# Altium project Balancing_Robot_1_2.PrjPcb (part 3 of 3)

## Sheet Balancing_Robot_1_2_Main.SchDoc: Hebrides Robot - Main
size A3; DrawnBy: Stuart Taylor; Revision: 1.2; SheetNumber: 1; SheetTotal: 3
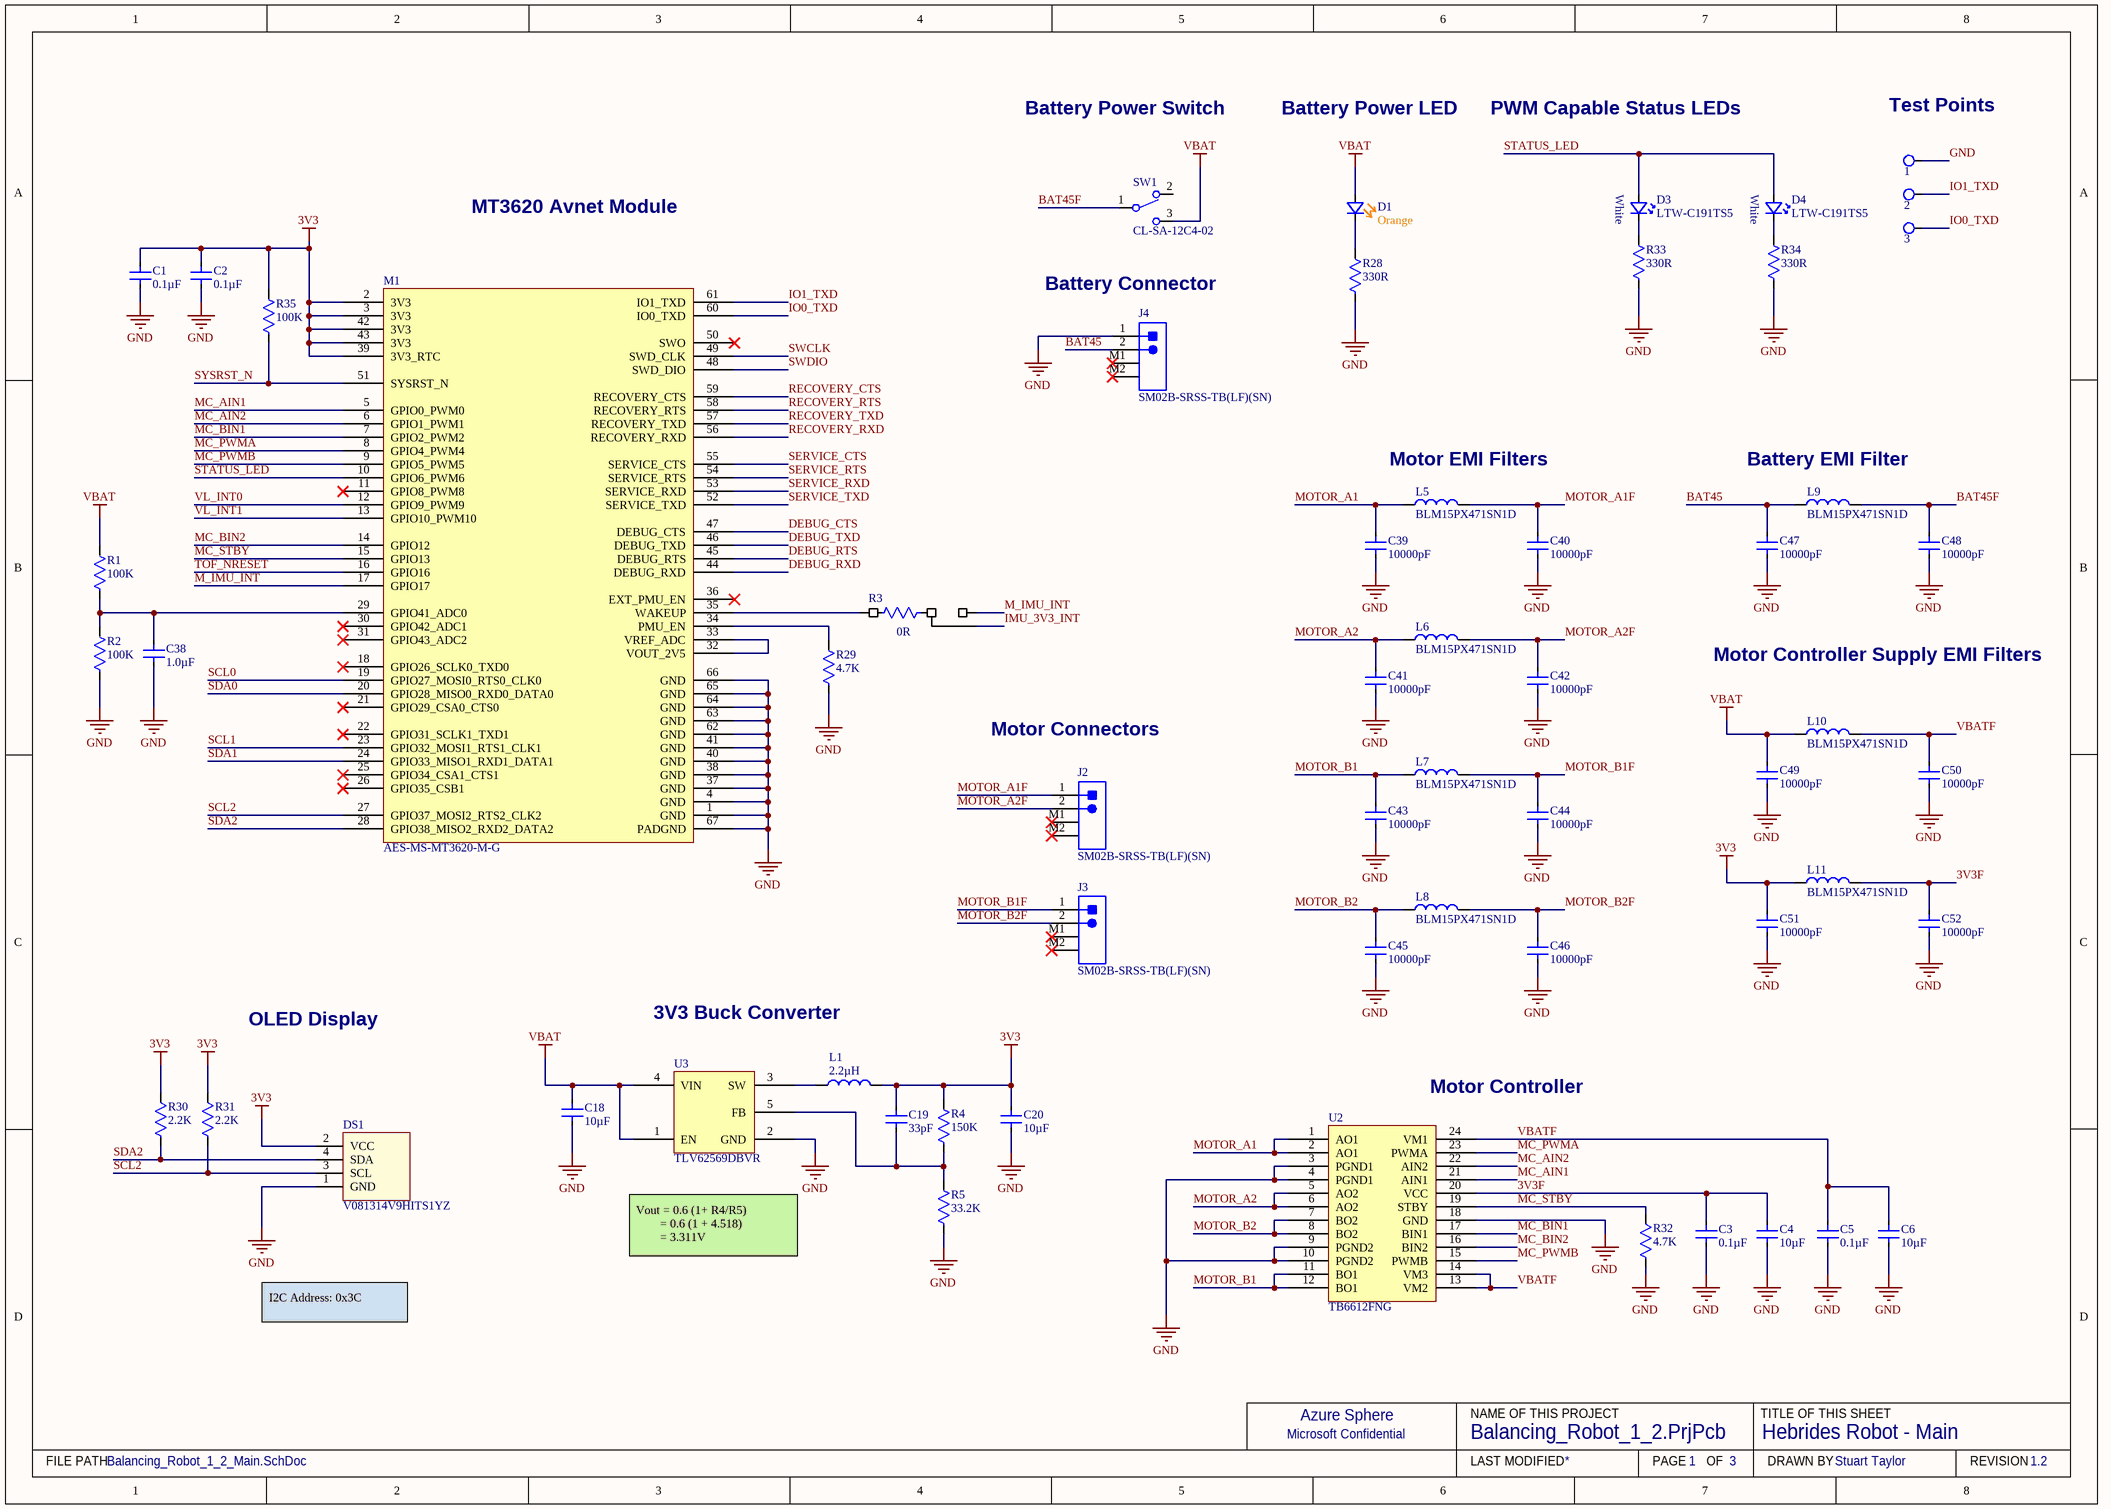
[diagram p2: Balancing_Robot_1_2_Main.SchDoc]

### Parts
1  TestPoint  [Pad1.27mm]  (value not drawn)  (no BOM)
2  TestPoint  [Pad1.27mm]  (value not drawn)  (no BOM)
3  TestPoint  [Pad1.27mm]  (value not drawn)  (no BOM)
C1  0.1µF  [CAPC1005-EIA0402 0.55MM MED]
C2  0.1µF  [CAPC1005-EIA0402 0.55MM MED]
C3  0.1µF  [CAPC1005-EIA0402 0.55MM MED]
C4  10µF  [CAPC1005-EIA0402 0.55MM MED]
C5  0.1µF  [CAPC1005-EIA0402 0.55MM MED]
C6  10µF  [CAPC1005-EIA0402 0.55MM MED]
C18  10µF  [CAPC1608-EIA0603-1MM-MED]
C19  33pF  [CAPC1005-EIA0402 0.55MM MED]
C20  10µF  [CAPC1005-EIA0402 0.55MM MED]
C38  Capacitance: 1.0µF  [CAPC1005-EIA0402 0.55MM MED]  (hidden comment: C1005X5R1V105K050BC)
C39  Capacitance: 10000pF  [CAPC1005-EIA0402 0.55MM MED]  (hidden comment: C1005X7R1H103K050BB)
C40  Capacitance: 10000pF  [CAPC1005-EIA0402 0.55MM MED]  (hidden comment: C1005X7R1H103K050BB)
C41  Capacitance: 10000pF  [CAPC1005-EIA0402 0.55MM MED]  (hidden comment: C1005X7R1H103K050BB)
C42  Capacitance: 10000pF  [CAPC1005-EIA0402 0.55MM MED]  (hidden comment: C1005X7R1H103K050BB)
C43  Capacitance: 10000pF  [CAPC1005-EIA0402 0.55MM MED]  (hidden comment: C1005X7R1H103K050BB)
C44  Capacitance: 10000pF  [CAPC1005-EIA0402 0.55MM MED]  (hidden comment: C1005X7R1H103K050BB)
C45  Capacitance: 10000pF  [CAPC1005-EIA0402 0.55MM MED]  (hidden comment: C1005X7R1H103K050BB)
C46  Capacitance: 10000pF  [CAPC1005-EIA0402 0.55MM MED]  (hidden comment: C1005X7R1H103K050BB)
C47  Capacitance: 10000pF  [CAPC1005-EIA0402 0.55MM MED]  (hidden comment: C1005X7R1H103K050BB)
C48  Capacitance: 10000pF  [CAPC1005-EIA0402 0.55MM MED]  (hidden comment: C1005X7R1H103K050BB)
C49  Capacitance: 10000pF  [CAPC1005-EIA0402 0.55MM MED]  (hidden comment: C1005X7R1H103K050BB)
C50  Capacitance: 10000pF  [CAPC1005-EIA0402 0.55MM MED]  (hidden comment: C1005X7R1H103K050BB)
C51  Capacitance: 10000pF  [CAPC1005-EIA0402 0.55MM MED]  (hidden comment: C1005X7R1H103K050BB)
C52  Capacitance: 10000pF  [CAPC1005-EIA0402 0.55MM MED]  (hidden comment: C1005X7R1H103K050BB)
D1  Colour: Orange  [Rohm SML-D12 Orange]  (hidden comment: SML-D12D)
D3  LTW-C191TS5  [LTW-C191TS5]
D4  LTW-C191TS5  [LTW-C191TS5]
DS1  V081314V9HITS1YZ  [Long_Display]
J2  SM02B-SRSS-TB(LF)(SN)  [SM02B-SRSS-TB]
J3  SM02B-SRSS-TB(LF)(SN)  [SM02B-SRSS-TB]
J4  SM02B-SRSS-TB(LF)(SN)  [SM02B-SRSS-TB]
L1  2.2µH  [NR3015T2R2M]
L5  BLM15PX471SN1D  [Generic Ferrite 0402]
L6  BLM15PX471SN1D  [Generic Ferrite 0402]
L7  BLM15PX471SN1D  [Generic Ferrite 0402]
L8  BLM15PX471SN1D  [Generic Ferrite 0402]
L9  BLM15PX471SN1D  [Generic Ferrite 0402]
L10  BLM15PX471SN1D  [Generic Ferrite 0402]
L11  BLM15PX471SN1D  [Generic Ferrite 0402]
M1  AES-MS-MT3620-M-G  [AES-MS-MT3620-M-G]
R1  100K  [RES 0402 MEDIUM DENSITY]
R2  100K  [RES 0402 MEDIUM DENSITY]
R3  0R  [THREE-WAY-0402-NO-SHORT]
R4  150K  [RES 0402 MEDIUM DENSITY]
R5  33.2K  [RES 0402 MEDIUM DENSITY]
R28  330R  [RES 0402 MEDIUM DENSITY]
R29  4.7K  [RES 0402 MEDIUM DENSITY]
R30  2.2K  [RES 0402 MEDIUM DENSITY]
R31  2.2K  [RES 0402 MEDIUM DENSITY]
R32  4.7K  [RES 0402 MEDIUM DENSITY]
R33  330R  [RES 0402 MEDIUM DENSITY]
R34  330R  [RES 0402 MEDIUM DENSITY]
R35  100K  [RES 0402 MEDIUM DENSITY]
SW1  CL-SA-12C4-02  [CL-SA-12C4-02]
U2  TB6612FNG  [TB6612FNG]
U3  TLV62569DBVR  [TI-SOT23-6]

### Nets
3V3: C1.2 C2.2 C19.2 C20.2 C51.2 DS1.2(VCC) L1.2 L11.1 M1.2(3V3) M1.3(3V3) M1.39(3V3_RTC) M1.42(3V3) M1.43(3V3) R4.1 R30.1 R31.1 R35.1
GND: 1.1 C1.1 C2.1 C3.1 C4.1 C5.1 C6.1 C18.1 C20.1 C38.1 C39.1 C40.1 C41.1 C42.1 C43.1 C44.1 C45.1 C46.1 C47.1 C48.1 C49.1 C50.1 C51.1 C52.1 DS1.1(GND) J4.1 M1.1(GND) M1.4(GND) M1.37(GND) M1.38(GND) M1.40(GND) M1.41(GND) M1.62(GND) M1.63(GND) M1.64(GND) M1.65(GND) M1.66(GND) M1.67(PADGND) R2.2 R5.2 R28.2 R29.2 R32.2 R33.2 R34.2 U2.3(PGND1) U2.4(PGND1) U2.9(PGND2) U2.10(PGND2) U2.18(GND) U3.2(GND)
VBAT: C18.2 C49.2 D1.2(A) L10.1 R1.1 SW1.3 U3.1(EN) U3.4(VIN)
3V3F: C3.2 C4.2 C52.2 L11.2 U2.20(VCC)
BAT45: C47.2 J4.2 L9.1
BAT45F: C48.2 L9.2 SW1.1
DEBUG_CTS: M1.47(DEBUG_CTS)
DEBUG_RTS: M1.45(DEBUG_RTS)
DEBUG_RXD: M1.44(DEBUG_RXD)
DEBUG_TXD: M1.46(DEBUG_TXD)
IMU_3V3_INT: R3.2
IO0_TXD: 3.1 M1.60(IO0_TXD)
IO1_TXD: 2.1 M1.61(IO1_TXD)
M_IMU_INT: M1.17(GPIO17) R3.3
MC_AIN1: M1.5(GPIO0_PWM0) U2.21(AIN1)
MC_AIN2: M1.6(GPIO1_PWM1) U2.22(AIN2)
MC_BIN1: M1.7(GPIO2_PWM2) U2.17(BIN1)
MC_BIN2: M1.14(GPIO12) U2.16(BIN2)
MC_PWMA: M1.8(GPIO4_PWM4) U2.23(PWMA)
MC_PWMB: M1.9(GPIO5_PWM5) U2.15(PWMB)
MC_STBY: M1.15(GPIO13) R32.1 U2.19(STBY)
MOTOR_A1: C39.2 L5.1 U2.1(AO1) U2.2(AO1)
MOTOR_A1F: C40.2 J2.1 L5.2
MOTOR_A2: C41.2 L6.1 U2.5(AO2) U2.6(AO2)
MOTOR_A2F: C42.2 J2.2 L6.2
MOTOR_B1: C43.2 L7.1 U2.11(BO1) U2.12(BO1)
MOTOR_B1F: C44.2 J3.1 L7.2
MOTOR_B2: C45.2 L8.1 U2.7(BO2) U2.8(BO2)
MOTOR_B2F: C46.2 J3.2 L8.2
RECOVERY_CTS: M1.59(RECOVERY_CTS)
RECOVERY_RTS: M1.58(RECOVERY_RTS)
RECOVERY_RXD: M1.56(RECOVERY_RXD)
RECOVERY_TXD: M1.57(RECOVERY_TXD)
SCL0: M1.19(GPIO27_MOSI0_RTS0_CLK0)
SCL1: M1.23(GPIO32_MOSI1_RTS1_CLK1)
SCL2: DS1.3(SCL) M1.27(GPIO37_MOSI2_RTS2_CLK2) R31.2
SDA0: M1.20(GPIO28_MISO0_RXD0_DATA0)
SDA1: M1.24(GPIO33_MISO1_RXD1_DATA1)
SDA2: DS1.4(SDA) M1.28(GPIO38_MISO2_RXD2_DATA2) R30.2
SERVICE_CTS: M1.55(SERVICE_CTS)
SERVICE_RTS: M1.54(SERVICE_RTS)
SERVICE_RXD: M1.53(SERVICE_RXD)
SERVICE_TXD: M1.52(SERVICE_TXD)
STATUS_LED: D3.2(A) D4.2(A) M1.10(GPIO6_PWM6)
SWCLK: M1.49(SWD_CLK)
SWDIO: M1.48(SWD_DIO)
SYSRST_N: M1.51(SYSRST_N) R35.2
TOF_NRESET: M1.16(GPIO16)
VBATF: C5.2 C6.2 C50.2 L10.2 U2.13(VM2) U2.14(VM3) U2.24(VM1)
VL_INT0: M1.12(GPIO9_PWM9)
VL_INT1: M1.13(GPIO10_PWM10)
NetC19_1: C19.1 R4.2 R5.1 U3.5(FB)
NetC38_2: C38.2 M1.29(GPIO41_ADC0) R1.2 R2.1
NetD1_1: D1.1(K) R28.1
NetD3_1: D3.1(K) R33.1
NetD4_1: D4.1(K) R34.1
NetL1_1: L1.1 U3.3(SW)
NetM1_32: M1.32(VOUT_2V5) M1.33(VREF_ADC)
NetM1_34: M1.34(PMU_EN) R29.1
NetM1_35: M1.35(WAKEUP) R3.1

Not connected (* = marked no-connect by the designer): J2 M1* M2*; J3 M1* M2*; J4 M1* M2*; M1 11(GPIO8_PWM8)* 18(GPIO26_SCLK0_TXD0)* 21(GPIO29_CSA0_CTS0)* 22(GPIO31_SCLK1_TXD1)* 25(GPIO34_CSA1_CTS1)* 26(GPIO35_CSB1)* 30(GPIO42_ADC1)* 31(GPIO43_ADC2)* 36(EXT_PMU_EN)* 50(SWO)*; SW1 2

### Notes on the sheet
- (near 1) Test Points
- Battery Power Switch
- Battery Power LED
- PWM Capable Status LEDs
- MT3620 Avnet Module
- Battery Connector
- (near L5) Motor EMI Filters
- (near L9) Battery EMI Filter
- Motor Controller Supply EMI Filters
- Motor Connectors
- OLED Display
- 3V3 Buck Converter
- (near U2) Motor Controller
- Vout = 0.6 (1+ R4/R5)
  = 0.6 (1 + 4.518)
  = 3.311V
- I2C Address: 0x3C
- Microsoft Confidential
- Azure Sphere
- NAME OF THIS PROJECT
- TITLE OF THIS SHEET
- FILE PATH
- LAST MODIFIED
- PAGE
- OF
- DRAWN BY
- REVISION

### Library data of the parts
1-3 = TestPoint: Test Point
C1-C3 C5 = 0.1µF 0402 X7R 50V: CAP CER 0.1UF 50V 10% X7R 0402; Manufacturer: TDK Corporation; Manufacturer Part Number: C1005X7R1H104K050BB; Supplier 1: Digi-Key; RoHS: RoHS Compliant; Category: Capacitors; Stock 1: 47833; Pricing 1: 0.01305; Packaging: Tape & Reel (TR); Tolerance: ±10%; Voltage - Rated: 50V; Temperature Coefficient: X7R; Mounting Type: Surface Mount, MLCC; Operating Temperature: -55°C ~ 125°C; Applications: General Purpose; Package / Case: 0402 (1005 Metric); Size / Dimension: 0.039" L x 0.020" W (1.00mm x 0.50mm); Height - Seated (Max): -; Thickness (Max): 0.022" (0.55mm); Lead Spacing: -; Features: -; Lead Style: -; ComponentLink1URL: http://product.tdk.com/en/catalog/datasheets/mlcc_commercial_general_en.pdf; ComponentLink1Description: http://product.tdk.com/en/catalog/datasheets/mlcc_commercial_general_en.pdf; Supplier Part Number 1: 445-5932-2-ND; Ratings: -; Capacitance: 0.1µF
C4 C6 C20 = 10µF 0402 X5R 6.3V: CAP CER 10UF 6.3V 20% X5R 0402; Manufacturer: TDK Corporation; Manufacturer Part Number: C1005X5R0J106M050BC; Supplier 1: Digi-Key; RoHS: RoHS Compliant; Category: Capacitors; Stock 1: 47833; Pricing 1: 0.07766; Packaging: Tape & Reel (TR); Tolerance: ±20%; Voltage - Rated: 6.3V; Temperature Coefficient: X5R; Mounting Type: Surface Mount, MLCC; Operating Temperature: -55°C ~ 125°C; Applications: General Purpose; Package / Case: 0402 (1005 Metric); Size / Dimension: 0.039" L x 0.020" W (1.00mm x 0.50mm); Height - Seated (Max): -; Thickness (Max): 0.020" (0.50mm); Lead Spacing: -; Features: -; Lead Style: -; ComponentLink1URL: http://product.tdk.com/en/catalog/datasheets/mlcc_commercial_general_en.pdf; ComponentLink1Description: http://product.tdk.com/en/catalog/datasheets/mlcc_commercial_general_en.pdf; Supplier Part Number 1: 445-8920-2-ND; Ratings: -; Capacitance: 10µF
C18 = 10µF 0603 X5R 25V: CAP CER 10UF 25V 20% X5R 0603; Manufacturer: TDK Corporation; Manufacturer Part Number: C1608X5R1E106M080AC; Supplier 1: Digi-Key; RoHS: RoHS Compliant; Category: Capacitors; Stock 1: 47833; Pricing 1: 0.00754; Packaging: Tape & Reel (TR); Tolerance: ±20%; Voltage - Rated: 25V; Temperature Coefficient: X5R; Mounting Type: Surface Mount, MLCC; Operating Temperature: -55°C ~ 125°C; Applications: General Purpose; Package / Case: 0603 (1608 Metric); Size / Dimension: 0.063" L x 0.031" W (1.60mm x 0.80mm); Height - Seated (Max): -; Thickness (Max): 0.039" (1.00mm); Lead Spacing: -; Features: -; Lead Style: -; ComponentLink1URL: http://product.tdk.com/en/catalog/datasheets/mlcc_commercial_general_en.pdf; ComponentLink1Description: http://product.tdk.com/en/catalog/datasheets/mlcc_commercial_general_en.pdf; Supplier Part Number 1: 445-9015-2-ND; Ratings: -; Capacitance: 10µF
C19 = 33pF 0402 C0G, NP0 50V: CAP CER 33PF 50V 5% NP0 0402; Manufacturer: TDK Corporation; Manufacturer Part Number: C1005C0G1H330J050BA; Supplier 1: Digi-Key; RoHS: RoHS Compliant; Category: Capacitors; Stock 1: 47833; Pricing 1: 0.00274; Packaging: Tape & Reel (TR); Tolerance: ±5%; Voltage - Rated: 50V; Temperature Coefficient: C0G, NP0; Mounting Type: Surface Mount, MLCC; Operating Temperature: -55°C ~ 125°C; Applications: General Purpose; Package / Case: 0402 (1005 Metric); Size / Dimension: 0.039" L x 0.020" W (1.00mm x 0.50mm); Height - Seated (Max): -; Thickness (Max): 0.022" (0.55mm); Lead Spacing: -; Features: -; Lead Style: -; ComponentLink1URL: http://product.tdk.com/en/catalog/datasheets/mlcc_commercial_general_en.pdf; ComponentLink1Description: http://product.tdk.com/en/catalog/datasheets/mlcc_commercial_general_en.pdf; Supplier Part Number 1: 445-1241-2-ND; Ratings: -; Capacitance: 33pF
C38 = 1.0µF 0402 X5R 35V: CAP CER 1UF 35V 10% X5R 0402; Manufacturer: TDK Corporation; Supplier 1: Digi-Key; Manufacturer Part Number: C1005X5R1V105K050BC; RoHS: RoHS Compliant; Category: Capacitors; Stock 1: 47833; Pricing 1: 0.0186; Packaging: Tape & Reel (TR); Tolerance: ±10%; Voltage - Rated: 35V; Temperature Coefficient: X5R; Mounting Type: Surface Mount, MLCC; Operating Temperature: -55°C ~ 125°C; Applications: General Purpose; Package / Case: 0402 (1005 Metric); Size / Dimension: 0.039" L x 0.020" W (1.00mm x 0.50mm); Height - Seated (Max): -; Thickness (Max): 0.022" (0.55mm); Lead Spacing: -; Features: -; Lead Style: -; ComponentLink1URL: http://product.tdk.com/en/catalog/datasheets/mlcc_commercial_general_en.pdf; ComponentLink1Description: http://product.tdk.com/en/catalog/datasheets/mlcc_commercial_general_en.pdf; Supplier Part Number 1: 445-9073-2-ND; Ratings: -
C39-C52 = 10000pF 0402 X7R 50V: CAP CER 10000PF 50V 10% X7R 0402; Manufacturer: TDK Corporation; Supplier 1: Digi-Key; Manufacturer Part Number: C1005X7R1H103K050BB; RoHS: RoHS Compliant; Category: Capacitors; Stock 1: 47833; Pricing 1: 0.00685; Packaging: Tape & Reel (TR); Tolerance: ±10%; Voltage - Rated: 50V; Temperature Coefficient: X7R; Mounting Type: Surface Mount, MLCC; Operating Temperature: -55°C ~ 125°C; Applications: General Purpose; Package / Case: 0402 (1005 Metric); Size / Dimension: 0.039" L x 0.020" W (1.00mm x 0.50mm); Height - Seated (Max): -; Thickness (Max): 0.022" (0.55mm); Lead Spacing: -; Features: -; Lead Style: -; ComponentLink1URL: http://product.tdk.com/en/catalog/datasheets/mlcc_commercial_general_en.pdf; ComponentLink1Description: http://product.tdk.com/en/catalog/datasheets/mlcc_commercial_general_en.pdf; Supplier Part Number 1: 445-6850-2-ND; Ratings: -
D1 = SML-D12D: 1.6 x 0.8 x 0.55mm (0603) LED 605nm Orange; Manufacturer: Rohm Semiconductor; Manufacturer Part Number: SML-D12D8WT86; Millicandela Rating: 100mcd; Voltage - Forward (Vf) (Typ): 2.2V; Current - Test: 20mA; Lens Type: Diffused, White; Lens Style/Size: Rectangle with Flat Top, 1.2mm x 0.8mm; Supplier 1: Digi-Key; RoHS: RoHS Compliant; Category: Optoelectronics; Stock 1: 1719; Pricing 1: 1=0.38, 10=0.279, 25=0.2232, 100=0.1478, 250=0.1046, 500=0.08926, 1000=0.06974 (GBP); Packaging: Cut Tape (CT); Wavelength - Dominant: 605nm; Wavelength - Peak: -; Viewing Angle: -; Package / Case: 0603 (1608 Metric); Size / Dimension: 1.60mm L x 0.80mm W; Height: 0.55mm; Mounting Type: Surface Mount; Luminous Flux @ Current - Test: -; ComponentLink1URL: http://rohmfs.rohm.com/en/products/databook/datasheet/opto/led/chip_mono/sml-d1.pdf; ComponentLink1Description: http://rohmfs.rohm.com/en/products/databook/datasheet/opto/led/chip_mono/sml-d1.pdf; Supplier Part Number 1: 511-1577-1-ND
D3 D4 = LTW-C191TS5: LED Uni-Color White 2-Pin Chip LED T/R; Manufacturer: Vishay Lite-On; Colour: White,Yellow; Lens Colour: Clear; Viewing Angle: 130°; Lens Style: Diffused,Colored,Rectangular,Tinted; Forward Current: 20mA; Forward Voltage: 3.15V; Power Rating: 70mW; Luminous Intensity: 112mcd; Test Current: 5mA; Correlated Colour Temperature (CCT): x=0.294/y=0.286; Number of Elements: 1; Reverse Voltage: 5V; Supplier 1: Digi-Key; Manufacturer Part Number: LTW-C191TS5; Stock 1: 149804; Pricing 1: 1=0.51, 10=0.396, 25=0.33, 100=0.2843, 250=0.2538, 500=0.2183, 1000=0.1685, 2500=0.1523 (USD); Mount: Surface Mount; Case/Package: 0603; Number of Pins: 2; Case Code (Metric): 1608; Case Code (Imperial): 0603; Min Operating Temperature: -20°C; Max Operating Temperature: 80°C; Package Quantity: 1; Packaging: Tape and Reel; Illumination Colour: White; Power Dissipation: 70mW; Number of LEDs: 1; Length: 1.6mm; Height: 0.55mm; Width: 0.8mm; Depth: 0.8mm; Radiation Hardening: No; Lead Free: Lead Free; ComponentLink1URL: https://datasheet.ciiva.com/11774/0900766b80e28fab-11774237.pdf; ComponentLink1Description: https://datasheet.ciiva.com/11774/0900766b80e28fab-11774237.pdf; ComponentLink2URL: https://datasheet.ciiva.com/25775/ltw-c191ts5-25775221.pdf; ComponentLink2Description: https://datasheet.ciiva.com/25775/ltw-c191ts5-25775221.pdf; ComponentLink3URL: https://datasheet.ciiva.com/15117/getdatasheetpartid-145287-15117825.pdf; ComponentLink3Description: https://datasheet.ciiva.com/15117/getdatasheetpartid-145287-15117825.pdf; ComponentLink4URL: https://datasheet.ciiva.com/12403/lite-on-ltw-c191ts5-190110-12403904.pdf; ComponentLink4Description: https://datasheet.ciiva.com/12403/lite-on-ltw-c191ts5-190110-12403904.pdf; ComponentLink5URL: https://datasheet.ciiva.com/26913/ltw-c191ts5-26913715.pdf; ComponentLink5Description: https://datasheet.ciiva.com/26913/ltw-c191ts5-26913715.pdf; ComponentLink6URL: https://datasheet.ciiva.com/16388/ltw-c191ts5-16388573.pdf; ComponentLink6Description: https://datasheet.ciiva.com/16388/ltw-c191ts5-16388573.pdf; ComponentLink7URL: https://datasheet.ciiva.com/2111/s-110-ltw-c191ts5-2111264.pdf; ComponentLink7Description: https://datasheet.ciiva.com/2111/s-110-ltw-c191ts5-2111264.pdf; Supplier Part Number 1: 160-1724-1-ND
J2-J4 = SM02B-SRSS-TB(LF)(SN): Conn Shrouded Header HDR 2 POS 1mm Solder RA SMD T/R; Manufacturer: JST; Number of Contacts: 2; Voltage Rating: 50V; Current Rating: 700mA; Insulation Resistance: 100MR; Connector Type: Header,Male Pin; Contact Resistance: 40mR; Max Current Rating: 1A; Supplier 1: Farnell; Manufacturer Part Number: SM02B-SRSS-TB(LF)(SN); Stock 1: 47603; Pricing 1: 100=0.24600, 500=0.21400, 1000=0.17700, 2500=0.15600, 5000=0.13600, 10000=0.13000 (GBP); RoHS: Yes; Mount: Surface Mount; Contact Material: Copper Alloy,Copper; Housing Color: Beige; Material: Polyamide; Housing Material: Polyamide; Contact Shape: Square; Insulation Material: Nylon; Insulation Color: Natural; Color: Natural; Contact Plating: Tin,Copper,Lead; Min Operating Temperature: -25°C; Max Operating Temperature: 85°C; Orientation: Right Angle; Termination: Solder; Number of Rows: 1; Number of Positions: 2; Max Voltage Rating (AC): 50V; Fastening Type: Push,Pull; Packaging: Tape and Reel; Voltage Rating (AC): 50V; Length: 4mm; Pitch: 1mm; Depth: 4.95mm; Lead Pitch: 1mm; Flammability Rating: UL94 V-0; Lead Free: Lead Free; REACH SVHC: No SVHC; ComponentLink1URL: https://datasheet.ciiva.com/26924/getdatasheetpartid-640850-26924055.pdf?src-supplier=Verical; ComponentLink1Description: https://datasheet.ciiva.com/26924/getdatasheetpartid-640850-26924055.pdf?src-supplier=Verical; ComponentLink2URL: https://datasheet.ciiva.com/712/esr-712467.pdf?src-supplier=Digi-Key; ComponentLink2Description: https://datasheet.ciiva.com/712/esr-712467.pdf?src-supplier=Digi-Key; ComponentLink3URL: https://datasheet.ciiva.com/712/esr-712468.pdf?src-supplier=Digi-Key; ComponentLink3Description: https://datasheet.ciiva.com/712/esr-712468.pdf?src-supplier=Digi-Key; ComponentLink4URL: https://datasheet.ciiva.com/730/esr-730600.pdf?src-supplier=Digi-Key; ComponentLink4Description: https://datasheet.ciiva.com/730/esr-730600.pdf?src-supplier=Digi-Key; ComponentLink5URL: https://datasheet.ciiva.com/8052/91630-8052284.pdf?src-supplier=Element14; ComponentLink5Description: https://datasheet.ciiva.com/8052/91630-8052284.pdf?src-supplier=Element14; ComponentLink6URL: https://datasheet.ciiva.com/16391/sm02b-srss-tblfsn-16391308.pdf?src-supplier=Future+Electronics; ComponentLink6Description: https://datasheet.ciiva.com/16391/sm02b-srss-tblfsn-16391308.pdf?src-supplier=Future+Electronics; Supplier Part Number 1: 1679117
L1 = NR3015T2R2M: FIXED IND 2.2UH 1.5A 72 MOHM SMD; Manufacturer: Taiyo Yuden; Type: Wirewound; Material - Core: Ferrite; Tolerance: ±20%; Current - Saturation: 1.48A; Shielding: Shielded; DC Resistance (DCR): 72 mOhm Max; Frequency - Self Resonant: 64MHz; Frequency - Test: 100kHz; Supplier 1: Digi-Key; Manufacturer Part Number: NR3015T2R2M; RoHS: RoHS Compliant; Category: Inductors, Coils, Chokes; Stock 1: 150589; Pricing 1: 1=0.23, 10=0.209, 25=0.1864, 50=0.163, 100=0.1513, 250=0.13964, 500=0.13268, 1000=0.10707 (GBP); Packaging: Cut Tape (CT); Inductance: 2.2µH; Current Rating: 1.5A; Q @ Freq: -; Ratings: -; Operating Temperature: -25°C ~ 120°C; Mounting Type: Surface Mount; Package / Case: Nonstandard; Size / Dimension: 0.118" L x 0.118" W (3.00mm x 3.00mm); Height - Seated (Max): 0.059" (1.50mm); ComponentLink1URL: http://ds.yuden.co.jp/TYCOMPAS/ut/detail.do?productNo=NR3015T2R2M&fileName=NR3015T2R2M_SS&mode=specSheetDownload; ComponentLink1Description: http://ds.yuden.co.jp/TYCOMPAS/ut/detail.do?productNo=NR3015T2R2M&fileName=NR3015T2R2M_SS&mode=specSheetDownload; Supplier Part Number 1: 587-1648-1-ND
L5-L11 = BLM15PX471SN1D: Murata; Material: Steel; Max DC Current: 1A; DC Resistance (DCR): 200mR; Test Frequency: 100MHz; Tolerance: 25%; Impedance: 470R; Number of Circuits: 1; Supplier 1: Digi-Key; Manufacturer: Murata; Manufacturer Part Number: BLM15PX471SN1D; Stock 1: 97005; Pricing 1: 1=0.15000, 10=0.12300, 25=0.09560, 50=0.07920, 100=0.06820, 250=0.05456, 500=0.04910, 1000=0.04092, 5000=0.03819 (USD); RoHS: Yes; Case/Package: 0402; Number of Pins: 2; Case Code (Imperial): 0402; Case Code (Metric): 1005; Min Operating Temperature: -55°C; Max Operating Temperature: 125°C; Termination: SMD/SMT; Packaging: Tape and Reel; Current Rating: 1A; Package Quantity: 1; Number of Lines: 1; Max Current Rating: 1A; Length: 1mm; Height: 0.5mm; Width: 0.5mm; Lead Free: Lead Free; ComponentLink1URL: https://datasheet.ciiva.com/41449/001172215-da-01-en-drossel-0402-470r-1-0x0-5mm-10000st-41449502.pdf?src-supplier=Conrad; ComponentLink1Description: https://datasheet.ciiva.com/41449/001172215-da-01-en-drossel-0402-470r-1-0x0-5mm-10000st-41449502.pdf?src-supplier=Conrad; ComponentLink2URL: https://datasheet.ciiva.com/29364/l0110e-29364075.pdf?src-supplier=Digi-Key; ComponentLink2Description: https://datasheet.ciiva.com/29364/l0110e-29364075.pdf?src-supplier=Digi-Key; Supplier Part Number 1: 490-10662-1-ND
M1 = AES-MS-MT3620-M-G (SAT)
R1 R2 R35 = 100K: RES 100K OHM 1/10W 1% 0402 SMD; Manufacturer: Panasonic Electronic Components; Manufacturer Part Number: ERJ-2RKF1003X; Power (Watts): 0.1W, 1/10W; Temperature Coefficient: ±100ppm/°C; Supplier 1: Digi-Key; Supplier Part Number 1: P100KLCT-ND; RoHS: RoHS Compliant; Category: Resistors; Stock 1: 2310913; Pricing 1: 1=0.07, 50=0.0128, 100=0.0097, 250=0.0072, 500=0.00532, 1000=0.00355, 5000=0.0025 (GBP); Packaging: Cut Tape (CT); Tolerance: ±1%; Composition: Thick Film; Features: -; Package / Case: 0402 (1005 Metric); Supplier Device Package: 0402; Size / Dimension: 0.039" L x 0.020" W (1.00mm x 0.50mm); Height: 0.016" (0.40mm); Number of Terminations: 2; ComponentLink1URL: http://industrial.panasonic.com/www-cgi/jvcr13pz.cgi?E+PZ+3+AOA0002+ERJ2RKF1003X+7+WW; ComponentLink1Description: http://industrial.panasonic.com/www-cgi/jvcr13pz.cgi?E+PZ+3+AOA0002+ERJ2RKF1003X+7+WW; Resistance (Ohms): 100K
R3 = THREE-WAY-0R-0402-NO-SHORT: RES SMD 0.0OHM JUMPER 1/10W 0402; Manufacturer: Panasonic Electronic Components; Manufacturer Part Number: ERJ-2GE0R00X; Resistance (Ohms): 0.0; Power (Watts): 0.1W, 1/10W; Supplier 1: Digi-Key; RoHS: RoHS Compliant; Category: Resistors; Stock 1: 3259868; Pricing 1: 1=0.08, 50=0.0104, 100=0.0079, 250=0.00588, 500=0.00436, 1000=0.0029, 5000=0.00204 (GBP); Packaging: Cut Tape (CT); Part Status: Active; Tolerance: Jumper; Composition: Thick Film; Features: Automotive AEC-Q200; Temperature Coefficient: -; Operating Temperature: -55°C ~ 155°C; Package / Case: 0402 (1005 Metric); Supplier Device Package: 0402; Size / Dimension: 0.039" L x 0.020" W (1.00mm x 0.50mm); Height: 0.016" (0.40mm); Number of Terminations: 2; Failure Rate: -; ComponentLink1URL: http://industrial.panasonic.com/www-cgi/jvcr13pz.cgi?E+PZ+3+AOA0001+ERJ2GE0R00X+7+WW; ComponentLink1Description: http://industrial.panasonic.com/www-cgi/jvcr13pz.cgi?E+PZ+3+AOA0001+ERJ2GE0R00X+7+WW; Supplier Part Number 1: P0.0JCT-ND
R4 = 150K: RES 150K OHM 1/10W 1% 0402 SMD; Manufacturer: Panasonic Electronic Components; Manufacturer Part Number: ERJ-2RKF1503X; Power (Watts): 0.1W, 1/10W; Temperature Coefficient: ±100ppm/°C; Supplier 1: Digi-Key; Supplier Part Number 1: P150KLCT-ND; RoHS: RoHS Compliant; Category: Resistors; Stock 1: 330002; Pricing 1: 1=0.07, 50=0.0128, 100=0.0097, 250=0.0072, 500=0.00532, 1000=0.00355, 5000=0.0025 (GBP); Packaging: Cut Tape (CT); Tolerance: ±1%; Composition: Thick Film; Features: -; Package / Case: 0402 (1005 Metric); Supplier Device Package: 0402; Size / Dimension: 0.039" L x 0.020" W (1.00mm x 0.50mm); Height: 0.016" (0.40mm); Number of Terminations: 2; ComponentLink1URL: http://industrial.panasonic.com/www-cgi/jvcr13pz.cgi?E+PZ+3+AOA0002+ERJ2RKF1503X+7+WW; ComponentLink1Description: http://industrial.panasonic.com/www-cgi/jvcr13pz.cgi?E+PZ+3+AOA0002+ERJ2RKF1503X+7+WW; Resistance (Ohms): 150K
R5 = 33.2K: RES 33.2K OHM 1/10W 1% 0402 SMD; Manufacturer: Panasonic Electronic Components; Manufacturer Part Number: ERJ-2RKF3322X; Power (Watts): 0.1W, 1/10W; Temperature Coefficient: ±100ppm/°C; Supplier 1: Digi-Key; Supplier Part Number 1: P33.2KLCT-ND; RoHS: RoHS Compliant; Category: Resistors; Stock 1: 313628; Pricing 1: 1=0.07, 50=0.0128, 100=0.0097, 250=0.0072, 500=0.00532, 1000=0.00355, 5000=0.0025 (GBP); Packaging: Cut Tape (CT); Tolerance: ±1%; Composition: Thick Film; Features: -; Package / Case: 0402 (1005 Metric); Supplier Device Package: 0402; Size / Dimension: 0.039" L x 0.020" W (1.00mm x 0.50mm); Height: 0.016" (0.40mm); Number of Terminations: 2; ComponentLink1URL: http://industrial.panasonic.com/www-cgi/jvcr13pz.cgi?E+PZ+3+AOA0002+ERJ2RKF3322X+7+WW; ComponentLink1Description: http://industrial.panasonic.com/www-cgi/jvcr13pz.cgi?E+PZ+3+AOA0002+ERJ2RKF3322X+7+WW; Resistance (Ohms): 33.2K
R28 R33 R34 = 330R: RES 330 OHM 1/10W 1% 0402 SMD; Manufacturer: Panasonic Electronic Components; Manufacturer Part Number: ERJ-2RKF3300X; Power (Watts): 0.1W, 1/10W; Temperature Coefficient: ±100ppm/°C; Supplier 1: Digi-Key; Supplier Part Number 1: P330LCT-ND; RoHS: RoHS Compliant; Category: Resistors; Stock 1: 586957; Pricing 1: 1=0.07, 50=0.0128, 100=0.0097, 250=0.0072, 500=0.00532, 1000=0.00355, 5000=0.0025 (GBP); Packaging: Cut Tape (CT); Tolerance: ±1%; Composition: Thick Film; Features: -; Package / Case: 0402 (1005 Metric); Supplier Device Package: 0402; Size / Dimension: 0.039" L x 0.020" W (1.00mm x 0.50mm); Height: 0.016" (0.40mm); Number of Terminations: 2; ComponentLink1URL: http://industrial.panasonic.com/www-cgi/jvcr13pz.cgi?E+PZ+3+AOA0002+ERJ2RKF3300X+7+WW; ComponentLink1Description: http://industrial.panasonic.com/www-cgi/jvcr13pz.cgi?E+PZ+3+AOA0002+ERJ2RKF3300X+7+WW; Resistance (Ohms): 330R
R29 R32 = 4.7K: RES 4.7K OHM 1/10W 1% 0402 SMD; Manufacturer: Panasonic Electronic Components; Manufacturer Part Number: ERJ-2RKF4701X; Power (Watts): 0.1W, 1/10W; Temperature Coefficient: ±100ppm/°C; Supplier 1: Digi-Key; Supplier Part Number 1: P4.70KLCT-ND; RoHS: RoHS Compliant; Category: Resistors; Stock 1: 1251398; Pricing 1: 1=0.07, 50=0.0128, 100=0.0097, 250=0.0072, 500=0.00532, 1000=0.00355, 5000=0.0025 (GBP); Packaging: Cut Tape (CT); Tolerance: ±1%; Composition: Thick Film; Features: -; Package / Case: 0402 (1005 Metric); Supplier Device Package: 0402; Size / Dimension: 0.039" L x 0.020" W (1.00mm x 0.50mm); Height: 0.016" (0.40mm); Number of Terminations: 2; ComponentLink1URL: http://industrial.panasonic.com/www-cgi/jvcr13pz.cgi?E+PZ+3+AOA0002+ERJ2RKF4701X+7+WW; ComponentLink1Description: http://industrial.panasonic.com/www-cgi/jvcr13pz.cgi?E+PZ+3+AOA0002+ERJ2RKF4701X+7+WW; Resistance (Ohms): 4.7K
R30 R31 = 2.2K: RES 2.2K OHM 1/10W 1% 0402 SMD; Manufacturer: Panasonic Electronic Components; Manufacturer Part Number: ERJ-2RKF2201X; Power (Watts): 0.1W, 1/10W; Temperature Coefficient: ±100ppm/°C; Supplier 1: Digi-Key; Supplier Part Number 1: P2.20KLCT-ND; RoHS: RoHS Compliant; Category: Resistors; Stock 1: 529147; Pricing 1: 1=0.07, 50=0.0128, 100=0.0097, 250=0.0072, 500=0.00532, 1000=0.00355, 5000=0.0025 (GBP); Packaging: Cut Tape (CT); Tolerance: ±1%; Composition: Thick Film; Features: -; Package / Case: 0402 (1005 Metric); Supplier Device Package: 0402; Size / Dimension: 0.039" L x 0.020" W (1.00mm x 0.50mm); Height: 0.016" (0.40mm); Number of Terminations: 2; ComponentLink1URL: http://industrial.panasonic.com/www-cgi/jvcr13pz.cgi?E+PZ+3+AOA0002+ERJ2RKF2201X+7+WW; ComponentLink1Description: http://industrial.panasonic.com/www-cgi/jvcr13pz.cgi?E+PZ+3+AOA0002+ERJ2RKF2201X+7+WW; Resistance (Ohms): 2.2K
SW1 = CL-SA-12C4-02: SWITCH SLIDE SPDT 500MA 12V; Manufacturer: Nidec Copal; Mechanical Life: 10000Cycles; Switch Travel: 1.6mm; Actuator Type: Standard; Switch Function: On-On; Contact Style: Non-Shorting; Electrical Life: 2000Cycles; Operating Force: 255gf; Actuator Length: 1.4mm; Supplier 1: Digi-Key; Manufacturer Part Number: CL-SA-12C4-02; Stock 1: 458; Pricing 1: 1=2.65000, 10=2.54200, 25=2.48760, 50=2.16320, 100=2.10910, 250=2.05504, 500=1.73056, 1000=1.62240, 5000=1.48720 (USD); RoHS: Yes; Mount: Through Hole; Contact Material: Gold; Min Operating Temperature: -40°C; Max Operating Temperature: 85°C; Termination: PC Pin; Packaging: Bulk; Current Rating: 500mA; Voltage Rating (DC): 12V; Throw Configuration: SPDT; Lead Free: Lead Free; ComponentLink1URL: https://datasheet.ciiva.com/18516/02682-18516832.pdf?src-supplier=Digi-Key; ComponentLink1Description: https://datasheet.ciiva.com/18516/02682-18516832.pdf?src-supplier=Digi-Key; Supplier Part Number 1: 563-1386-ND
U2 = TB6612FNG: DC Motor Driver 3V 24-Pin SSOP T/R; Manufacturer: Toshiba; Manufacturer Part Number: TB6612FNG,C,8,EL; Output Current: 1A; Number of Outputs: 2; Logic Function: AND; Interface: Parallel; Min Supply Voltage: 2.7V; Max Supply Voltage: 5.5V; Supplier 1: Digi-Key; Stock 1: 11070; Pricing 1: 1=1.95000, 10=1.74900, 25=1.65000, 100=1.32000, 250=1.15500, 500=1.12200, 1000=0.89100 (USD); RoHS: Yes; Mount: Surface Mount; Case/Package: SSOP; Number of Pins: 24; Min Operating Temperature: -20°C; Max Operating Temperature: 85°C; Package Quantity: 1; Packaging: Tape and Reel; Operating Supply Voltage: 3V; ComponentLink1URL: https://datasheet.ciiva.com/12216/tb6612fng-datasheet-en-20141001-12216529.pdf?src-supplier=Mouser; ComponentLink1Description: https://datasheet.ciiva.com/12216/tb6612fng-datasheet-en-20141001-12216529.pdf?src-supplier=Mouser; Supplier Part Number 1: TB6612FNGC8ELCT-ND
U3 = TLV62569DBVR: Variable voltage buck converter; pin to pad: 5>6; Manufacturer: Texas Instruments; Supplier 1: Digi-Key; Manufacturer Part Number: TLV62569DBVR; Stock 1: 4987; Pricing 1: 1=1.32, 10=1.176, 100=0.9168, 500=0.75736, 1000=0.59792 (USD); Case/Package: SOT-23-5; Min Operating Temperature: -40°C; Max Operating Temperature: 125°C; Supplier Part Number 1: 296-47360-6-ND
DS1 = V081314V9HITS1YZ: ComponentLink1Description: Supplier; ComponentLink1URL: https://www.amazon.co.uk/gp/product/B07BDFXFRK/ref=ppx_yo_dt_b_asin_title_o08_s00?ie=UTF8&psc=1

## Nets that join several sheets
3V3: Balancing_Robot_1_2_Sensors (20 pins), Balancing_Robot_1_2_Main (17 pins)
GND: Balancing_Robot_1_2_FTDI (45 pins), Balancing_Robot_1_2_Sensors (36 pins), Balancing_Robot_1_2_Main (51 pins)
DEBUG_CTS: Balancing_Robot_1_2_FTDI (U9.18), Balancing_Robot_1_2_Main (M1.47)
DEBUG_RTS: Balancing_Robot_1_2_FTDI (R14.1 U9.19), Balancing_Robot_1_2_Main (M1.45)
DEBUG_RXD: Balancing_Robot_1_2_FTDI (U9.16), Balancing_Robot_1_2_Main (M1.44)
DEBUG_TXD: Balancing_Robot_1_2_FTDI (U9.17), Balancing_Robot_1_2_Main (M1.46)
IMU_3V3_INT: Balancing_Robot_1_2_Sensors (Q3.3 R27.2), Balancing_Robot_1_2_Main (R3.2)
RECOVERY_CTS: Balancing_Robot_1_2_FTDI (U9.53), Balancing_Robot_1_2_Main (M1.59)
RECOVERY_RTS: Balancing_Robot_1_2_FTDI (U9.54), Balancing_Robot_1_2_Main (M1.58)
RECOVERY_RXD: Balancing_Robot_1_2_FTDI (U9.48), Balancing_Robot_1_2_Main (M1.56)
RECOVERY_TXD: Balancing_Robot_1_2_FTDI (U9.52), Balancing_Robot_1_2_Main (M1.57)
SCL0: Balancing_Robot_1_2_Sensors (Q2.3 RP6.1), Balancing_Robot_1_2_Main (M1.19)
SCL1: Balancing_Robot_1_2_Sensors (RP4.3 U4.14), Balancing_Robot_1_2_Main (M1.23)
SDA0: Balancing_Robot_1_2_Sensors (Q1.3 RP6.3), Balancing_Robot_1_2_Main (M1.20)
SDA1: Balancing_Robot_1_2_Sensors (RP4.1 U4.15), Balancing_Robot_1_2_Main (M1.24)
SERVICE_CTS: Balancing_Robot_1_2_FTDI (U9.40), Balancing_Robot_1_2_Main (M1.55)
SERVICE_RTS: Balancing_Robot_1_2_FTDI (U9.41), Balancing_Robot_1_2_Main (M1.54)
SERVICE_RXD: Balancing_Robot_1_2_FTDI (U9.38), Balancing_Robot_1_2_Main (M1.53)
SERVICE_TXD: Balancing_Robot_1_2_FTDI (U9.39), Balancing_Robot_1_2_Main (M1.52)
SWCLK: Balancing_Robot_1_2_FTDI (RP2.2), Balancing_Robot_1_2_Main (M1.49)
SWDIO: Balancing_Robot_1_2_FTDI (RP2.6 U15.5), Balancing_Robot_1_2_Main (M1.48)
SYSRST_N: Balancing_Robot_1_2_FTDI (R6.2 R24.2), Balancing_Robot_1_2_Main (M1.51 R35.2)
TOF_NRESET: Balancing_Robot_1_2_Sensors (R25.2 U4.3 U5.1 U5.6), Balancing_Robot_1_2_Main (M1.16)
VL_INT0: Balancing_Robot_1_2_Sensors (U5.5), Balancing_Robot_1_2_Main (M1.12)
VL_INT1: Balancing_Robot_1_2_Sensors (U5.9), Balancing_Robot_1_2_Main (M1.13)